# EAGLE design hyone (EAGLE 6.6.0)
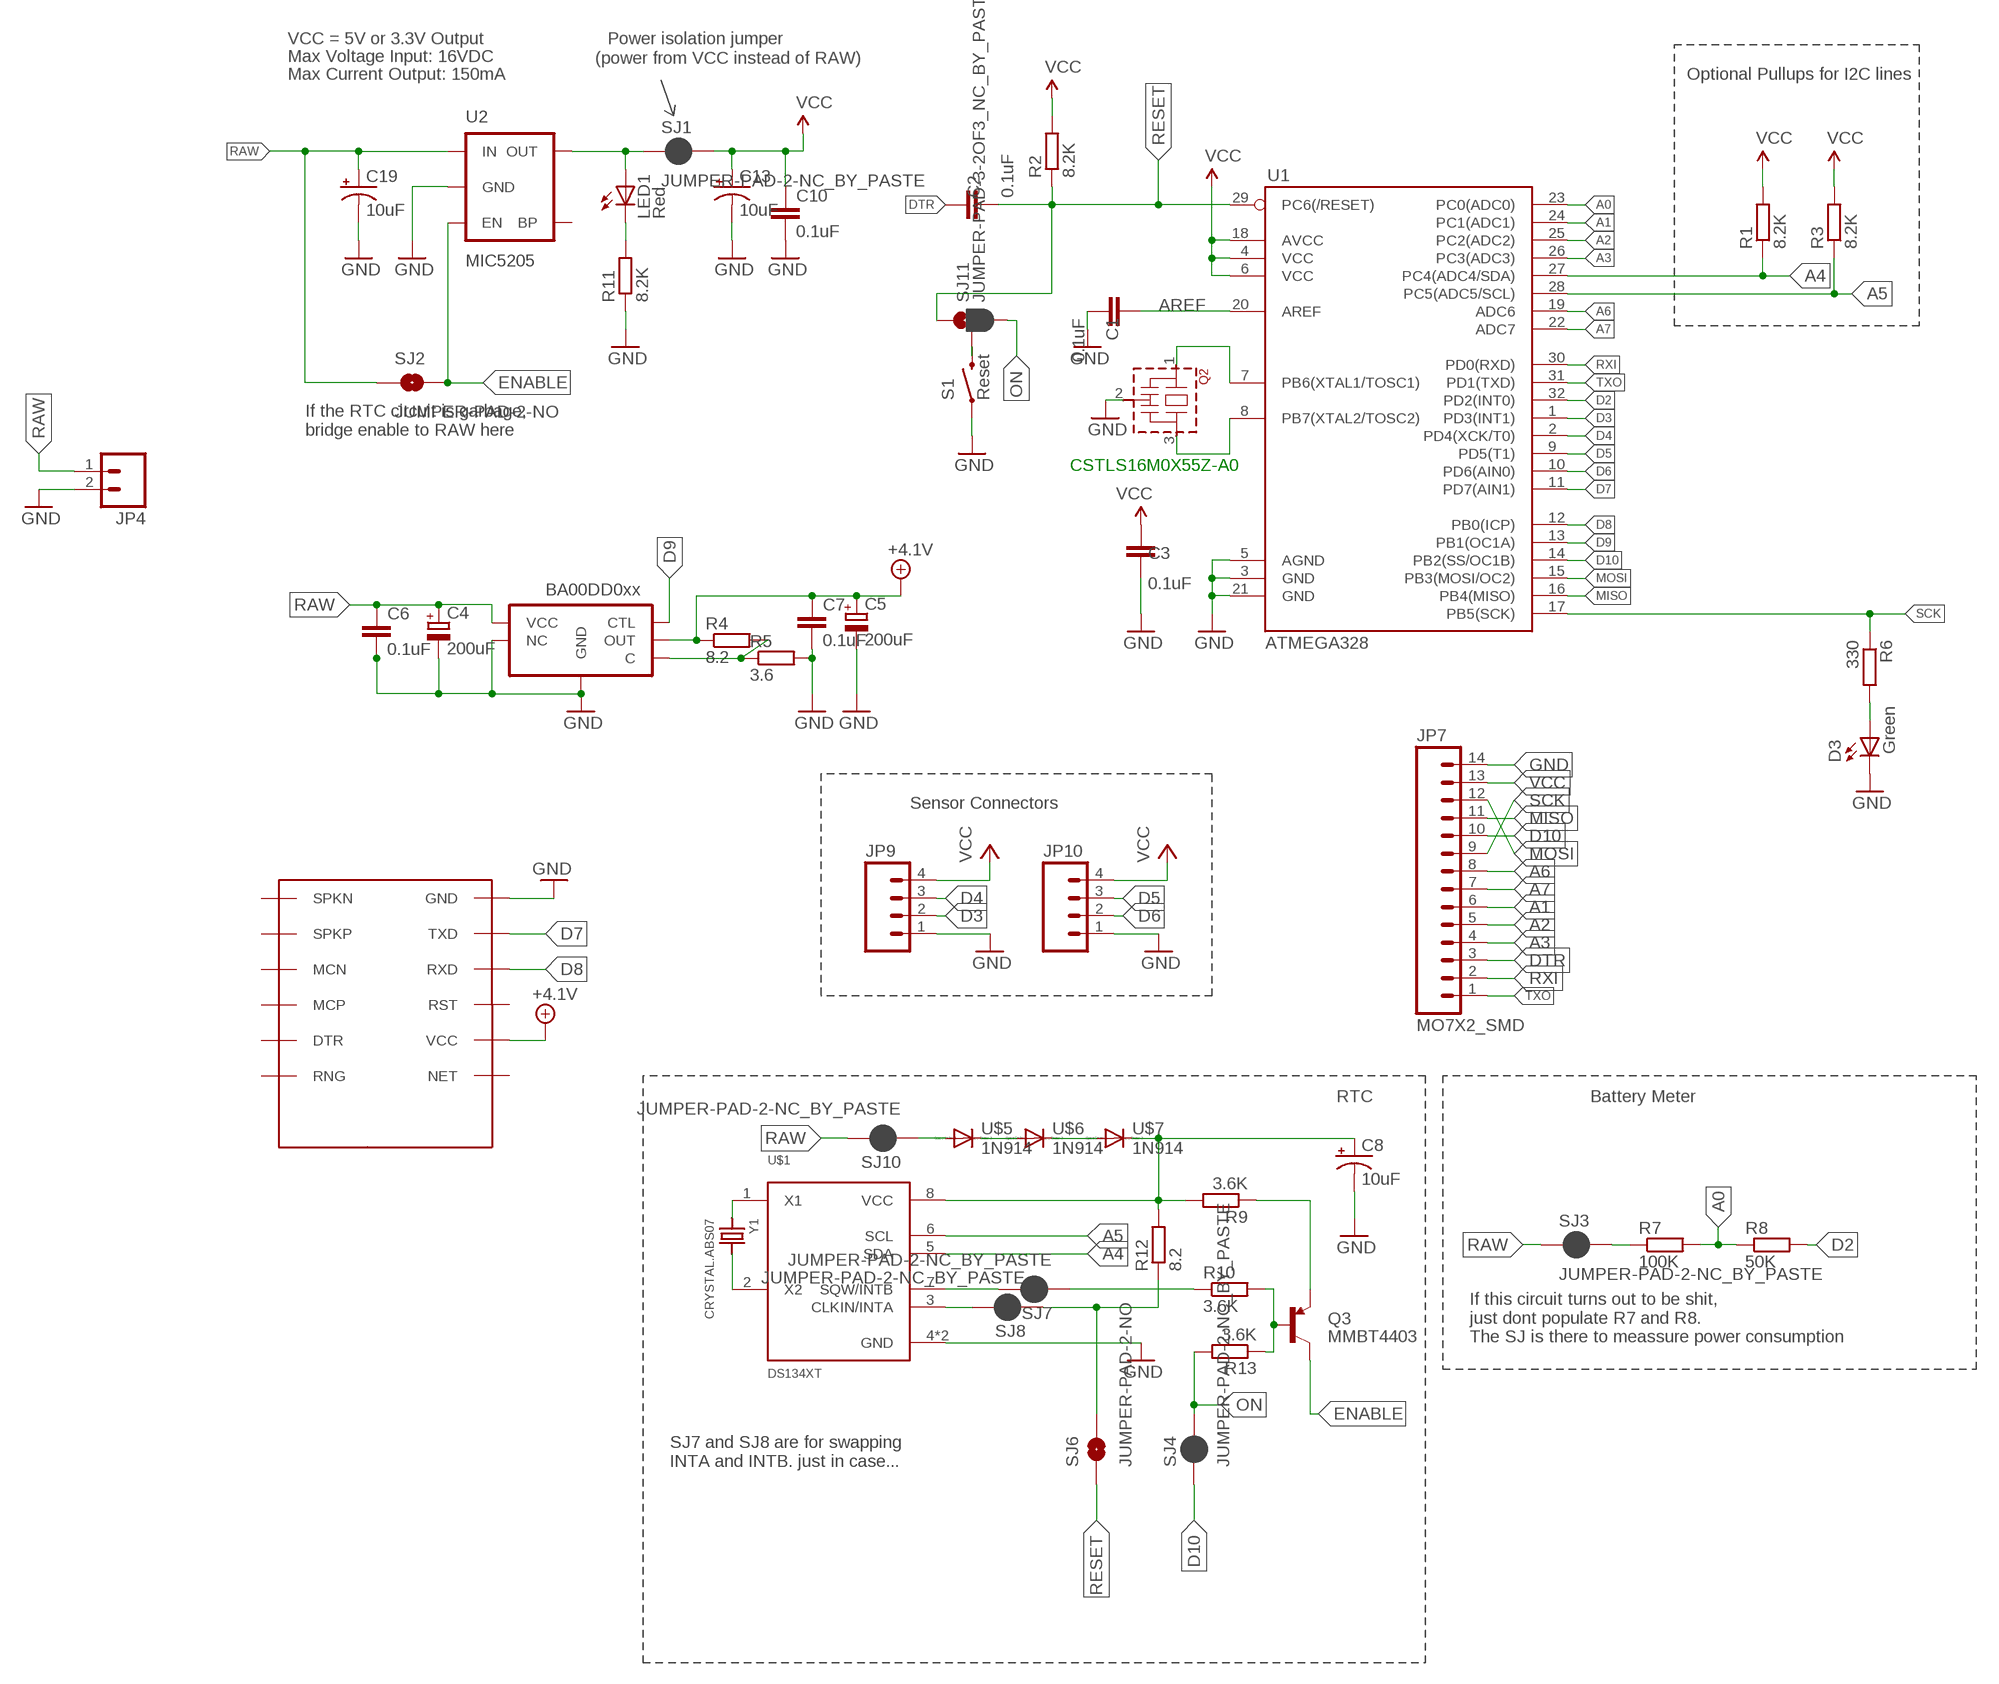
[diagram p0: schematic, sheet 1]

## Parts
C1  0.1uF  C-EUC0805  [C0805]
C2  0.1uF  C-EUC0805  [C0805]
C3  0.1uF  C-EUC0805  [C0805]
C4  200uF  CPOL-EUE5-5  [E5-5]
C5  200uF  CPOL-EUE5-5  [E5-5]
C6  0.1uF  C-EUC0805  [C0805]
C7  0.1uF  C-EUC0805  [C0805]
C8  10uF  CAP_POL1206  [EIA3216]
C10  0.1uF  C-EUC0805  [C0805]
C13  10uF  CAP_POL1206  [EIA3216]
C19  10uF  CAP_POL1206  [EIA3216]
D3  Green  LEDCHIPLED_0805  [CHIPLED_0805]
JP4  M02POLAR  [MOLEX-1X2]
JP7  MO7X2_SMD  [2X7_SMD]
JP9  M04POLAR  [MOLEX-1X4]
JP10  M04POLAR  [MOLEX-1X4]
LED1  Red  LEDCHIPLED_0805  [CHIPLED_0805]
Q2  CSTLS_X  [CSTLS_X]
Q3  MMBT4403  TRANSISTOR_PNPMMBT4403  [SOT23-3]
R1  8.2K  R-EU_R1206  [R1206]
R2  8.2K  R-EU_R1206  [R1206]
R3  8.2K  R-EU_R1206  [R1206]
R4  8.2  R-EU_R1206  [R1206]
R5  3.6  R-EU_R1206  [R1206]
R6  330  R-EU_R1206  [R1206]
R7  100K  R-EU_R1206  [R1206]
R8  50K  R-EU_R1206  [R1206]
R9  3.6K  R-EU_R1206  [R1206]
R10  3.6K  R-EU_R1206  [R1206]
R11  8.2K  R-EU_R1206  [R1206]
R12  8.2  R-EU_R1206  [R1206]
R13  3.6K  R-EU_R1206  [R1206]
S1  Reset  SWITCH-MOMENTARY-2SMD-ALT01  [TACTILE-SWITCH-SMD-ALT01]
SJ1  JUMPER-PAD-2-NC_BY_PASTE  [PAD-JUMPER-2-NC_BY_PASTE_YES_SILK]
SJ2  JUMPER-PAD-2-NO  [PAD-JUMPER-2-NO_NO_SILK]
SJ3  JUMPER-PAD-2-NC_BY_PASTE  [PAD-JUMPER-2-NC_BY_PASTE_YES_SILK]
SJ4  JUMPER-PAD-2-NC_BY_PASTE  [PAD-JUMPER-2-NC_BY_PASTE_YES_SILK]
SJ6  JUMPER-PAD-2-NO  [PAD-JUMPER-2-NO_NO_SILK]
SJ7  JUMPER-PAD-2-NC_BY_PASTE  [PAD-JUMPER-2-NC_BY_PASTE_YES_SILK]
SJ8  JUMPER-PAD-2-NC_BY_PASTE  [PAD-JUMPER-2-NC_BY_PASTE_YES_SILK]
SJ10  JUMPER-PAD-2-NC_BY_PASTE  [PAD-JUMPER-2-NC_BY_PASTE_YES_SILK]
SJ11  JUMPER-PAD-3-2OF3_NC_BY_PASTE  [PAD-JUMPER-3-2OF3_NC_BY_PASTE_YES_SILK_FULL_BOX]
U1  ATMEGA328  ATMEGA168  [TQFP32-08]
U2  MIC5205  V_REG_LDOSMD  [SOT23-5]
U$1  DS134XT  [TDFN-8]
U$2  BA00DD0XX  [HRP5]
U$4  SIM800L  [SIM-CORE]
U$5  1N914  [SOT23]
U$6  1N914  [SOT23]
U$7  1N914  [SOT23]
Y1  CRYSTAL.ABS07  [ABS07]

## Nets
123123 [vcc]: SJ10.1 U$5.1(A)
+4.1V: C5.+ C7.1 R4.1 U$2.4(OUT) U$4.VCC
A0: R7.2 R8.1 U1.23(PC0(ADC0))
A1: JP7.6 U1.24(PC1(ADC1))
A2: JP7.5 U1.25(PC2(ADC2))
A3: JP7.4 U1.26(PC3(ADC3))
A4: R1.1 U1.27(PC4(ADC4/SDA)) U$1.5(SDA)
A5: R3.1 U1.28(PC5(ADC5/SCL)) U$1.6(SCL)
A6: JP7.8 U1.19(ADC6)
A7: JP7.7 U1.22(ADC7)
AREF: C1.2 U1.20(AREF)
D2: R8.2 U1.32(PD2(INT0))
D3: JP9.2 U1.1(PD3(INT1))
D4: JP9.3 U1.2(PD4(XCK/T0))
D5: JP10.3 U1.9(PD5(T1))
D6: JP10.2 U1.10(PD6(AIN0))
D7: U1.11(PD7(AIN1)) U$4.TXD
D8: U1.12(PB0(ICP)) U$4.RXD
D9: U1.13(PB1(OC1A)) U$2.1(CTL)
D10: JP7.10 SJ4.1 U1.14(PB2(SS/OC1B))
DTR: C2.2 JP7.3
ENABLE: Q3.3(C) SJ2.2 U2.3(EN)
GND [vcc]: C1.1 C3.1 C4.- C5.- C6.2 C7.2 C8.C(-) C10.2 C13.C(-) C19.C(-) D3.C JP4.2 JP7.14 JP9.1 JP10.1 Q2.2(VSS) R5.2 R11.1 S1.1 S1.2 U1.3(GND) U1.5(AGND) U1.21(GND) U2.2(GND) U$1.4(GND) U$1.EP(GND) U$2.3(NC) U$2.6(GND) U$4.GND
MISO: JP7.11 U1.16(PB4(MISO))
MOSI: JP7.12 U1.15(PB3(MOSI/OC2))
N$1: Q2.1 U1.7(PB6(XTAL1/TOSC1))
N$2: Q2.3 U1.8(PB7(XTAL2/TOSC2))
N$3: LED1.A SJ1.1 U2.5(OUT)
N$4: LED1.C R11.2
N$5: R4.2 R5.1 U$2.5(C)
N$6: U$1.1(X1) Y1.1
N$7: D3.A R6.2
N$8: U$1.2(X2) Y1.2
N$9: Q3.2(E) R9.1
N$10: Q3.1(B) R10.2 R13.1
N$11: C8.A(+) R9.2 R12.2 U$1.8(VCC) U$7.3(C)
N$12: R10.1 SJ7.1
N$13: R7.1 SJ3.2
N$14: S1.3 S1.4 SJ11.2
N$15: R12.1 SJ6.2 SJ8.1
N$16: SJ7.2 U$1.7(SQW/INTB)
N$17: SJ8.2 U$1.3(CLKIN/INTA)
N$18: U$5.3(C) U$6.1(A)
N$19: U$6.3(C) U$7.1(A)
ON: R13.2 SJ4.2 SJ11.3
RAW [vcc]: C4.+ C6.1 C19.A(+) JP4.1 SJ2.1 SJ3.1 SJ10.2 U2.1(IN) U$2.2(VCC)
RESET: C2.1 R2.1 SJ6.1 SJ11.1 U1.29(PC6(/RESET))
RXI: JP7.2 U1.30(PD0(RXD))
SCK: JP7.9 R6.1 U1.17(PB5(SCK))
TXO: JP7.1 U1.31(PD1(TXD))
VCC: C3.2 C10.1 C13.A(+) JP7.13 JP9.4 JP10.4 R1.2 R2.2 R3.2 SJ1.2 U1.4(VCC) U1.6(VCC) U1.18(AVCC)
Unconnected: U2.4(BP) U$4.DTR U$4.MCN U$4.MCP U$4.NET U$4.RNG U$4.RST U$4.SPKN U$4.SPKP

## Notes on the sheet
- VCC = 5V or 3.3V Output | Power isolation jumper
- Max Voltage Input: 16VDC | (power from VCC instead of RAW)
- Max Current Output: 150mA | Optional Pullups for I2C lines
- If the RTC circuit is garbage, 
  bridge enable to RAW here
- CSTLS16M0X55Z-A0
- Sensor Connectors
- RTC | Battery Meter
- If this circuit turns out to be shit,
  just dont populate R7 and R8.
  The SJ is there to meassure power consumption
- SJ7 and SJ8 are for swapping 
  INTA and INTB. just in case...

## Library data of the parts
C1-C3 C6 C7 C10 = rcl:C-EU: CAPACITOR, European symbol
C4 C5 = resistor:CPOL-EU: POLARIZED CAPACITOR, European symbol
C8 C13 C19 = SparkFun:CAP_POL: Capacitor Polarized These are standard SMD and PTH capacitors. Normally 10uF, 47uF, and 100uF in electrolytic and tantalum varieties. Always verify the external diameter of the through hole cap, it varies with capacity, voltage, and manufacturer. The EIA devices should be standard.
D3 LED1 = led:LED: LED OSRAM: - CHIPLED LG R971, LG N971, LY N971, LG Q971, LY Q971, LO R971, LY R971 LH N974, LH R974 LS Q976, LO Q976, LY Q976 LO Q996 - Hyper CHIPLED LW Q18S LB Q993, LB Q99A, LB R99A - SideLED LS A670, LO A670, LY A670, LG A670, LP A670 LB A673, LV A673, LT A673, LW A673 LH A674 LY A675 LS A676, LA A676, LO A676, LY A676, LW A676 LS A679, LY A679, LG A679 - Hyper Micro SIDELED® LS Y876, LA Y876, LO Y876, LY Y876 LT Y87S - SmartLED LW L88C, LW L88S LB L89C, LB L89S, LG L890 LS L89K, LO L89K, LY L89K LS L896, LA L896, LO L896, LY L896 - TOPLED LS T670, LO T670, LY T670, LG T670, LP T670 LSG T670, LSP T670, LSY T670, LOP T670, LYG T670 LG T671, LOG T671, LSG T671 LB T673, LV T673, LT T673, LW T673 LH T674 LS T676, LA T676, LO T676, LY T676, LB T676, LH T676, LSB T676, LW T676 LB T67C, LV T67C, LT T67C, LS T67K, LO T67K, LY T67K, LW E67C LS E67B, LA E67B, LO E67B, LY E67B, LB E67C, LV E67C, LT E67C LW T67C LS T679, LY T679, LG T679 LS T770, LO T770, LY T770, LG T770, LP T770 LB T773, LV T773, LT T773, LW T773 LH T774 LS E675, LA E675, LY E675, LS T675 LS T776, LA T776, LO T776, LY T776, LB T776 LHGB T686 LT T68C, LB T68C - Hyper Mini TOPLED® LB M676 - Mini TOPLED Santana® LG M470 LS M47K, LO M47K, LY M47K Source: http://www.osram.convergy.de LUXEON: - LUMILED® LXK2-PW12-R00, LXK2-PW12-S00, LXK2-PW14-U00, LXK2-PW14-V00 LXK2-PM12-R00, LXK2-PM12-S00, LXK2-PM14-U00 LXK2-PE12-Q00, LXK2-PE12-R00, LXK2-PE12-S00, LXK2-PE14-T00, LXK2-PE14-U00 LXK2-PB12-K00, LXK2-PB12-L00, LXK2-PB12-M00, LXK2-PB14-N00, LXK2-PB14-P00, LXK2-PB14-Q00 LXK2-PR12-L00, LXK2-PR12-M00, LXK2-PR14-Q00, LXK2-PR14-R00 LXK2-PD12-Q00, LXK2-PD12-R00, LXK2-PD12-S00 LXK2-PH12-R00, LXK2-PH12-S00 LXK2-PL12-P00, LXK2-PL12-Q00, LXK2-PL12-R00 Source: www.luxeon.com KINGBRIGHT: KA-3528ASYC Source: www.kingbright.com
JP4 = SparkFun-Connectors:M02: Standard 2-pin 0.1" header. Use with - straight break away headers ( PRT-00116) - right angle break away headers (PRT-00553) - swiss pins (PRT-00743) - machine pins (PRT-00117) - female headers (PRT-00115) Molex polarized connector foot print use with: PRT-08233 with associated crimp pins and housings. 2.54_SCREWTERM for use with PRT-10571. 3.5mm Screw Terminal footprints for PRT-08084 5mm Screw Terminal footprints for use with PRT-08432
JP7 = SparkFun-Connectors:MO7X2_SMD
JP9 JP10 = SparkFun-Connectors:M04: Header 4 Standard 4-pin 0.1" header. Use with straight break away headers (SKU : PRT-00116), right angle break away headers (PRT-00553), swiss pins (PRT-00743), machine pins (PRT-00117), and female headers (PRT-00115). Molex polarized connector foot print use with SKU : PRT-08231 with associated crimp pins and housings. 1MM SMD Version SKU: PRT-10208
Q2 = murata-resonators:CSTLS_X: Ceramic resonator 16.00 to 70.00 MHz
Q3 = SparkFun-DiscreteSemi:TRANSISTOR_PNP: Generic PNP BJT Double check pinouts against datasheets- not all devices are the same! MMBT3906 - 40V 200mA SOT-23 (TRANS-08052) MMBT4403 - 40V 600mA SOT-23 (TRANS-09245); PROD_ID: TRANS-09245
R1-R3 R6 R9-R11 R13 = rcl:R-EU_: RESISTOR, European symbol
R4 R5 R7 R8 R12 = resistor:R-EU_: RESISTOR, European symbol
S1 = Testing:SWITCH-MOMENTARY-2: Various NO switches- pushbuttons, reed, etc
SJ1 SJ3 SJ4 SJ7 SJ8 SJ10 = SparkFun-Passives:JUMPER-PAD-2-NC_BY_PASTE
SJ2 SJ6 = SparkFun-Passives:JUMPER-PAD-2-NO
SJ11 = SparkFun-Passives:JUMPER-PAD-3-2OF3_NC_BY_PASTE
U1 = SparkFun:ATMEGA168
U2 = SparkFun:V_REG_LDO: Voltage Regulator LDO Standard 150mA LDO voltage regulator in SOT-23 layout. Micrel part MIC5205. BP (by-pass) pin is used to lower output noise with 470pF cap.
U$1 = borkedlabs-clock:DS134XT
U$2 = rohm-semi:BA00DD0XX
U$4 = aep:SIM800L
U$5-U$7 = diode:1N914
Y1 = abracon:CRYSTAL

## Net classes
0 default: width 0.203 mm
1 vcc: width 0.254 mm

## Board
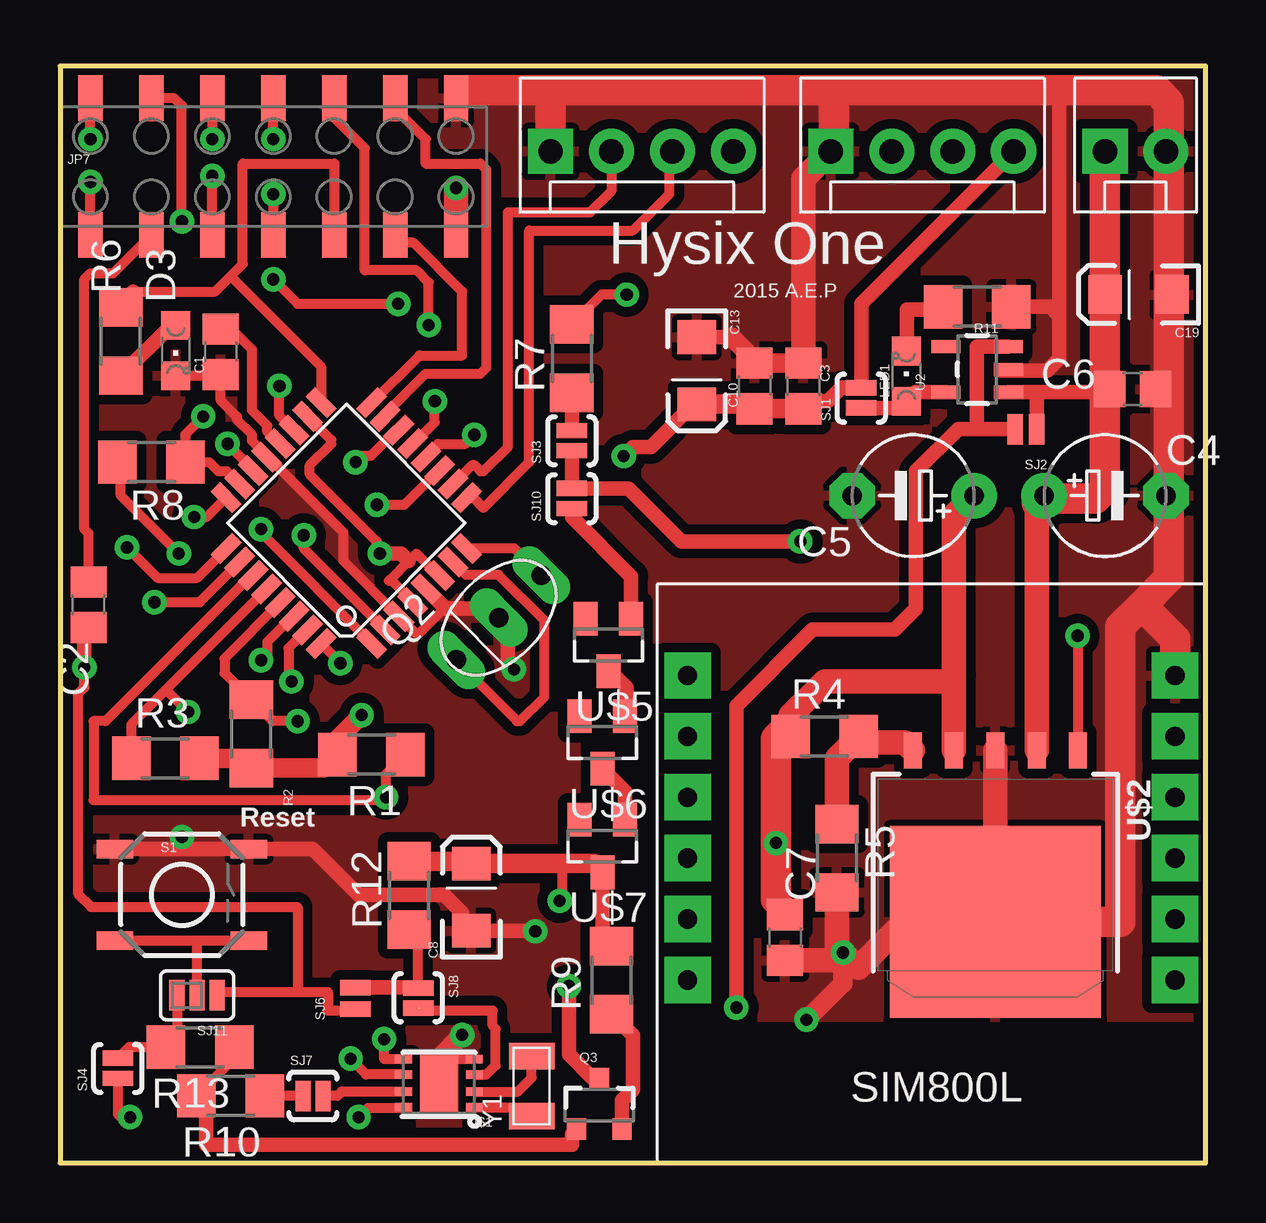
[diagram p1: board, top side]
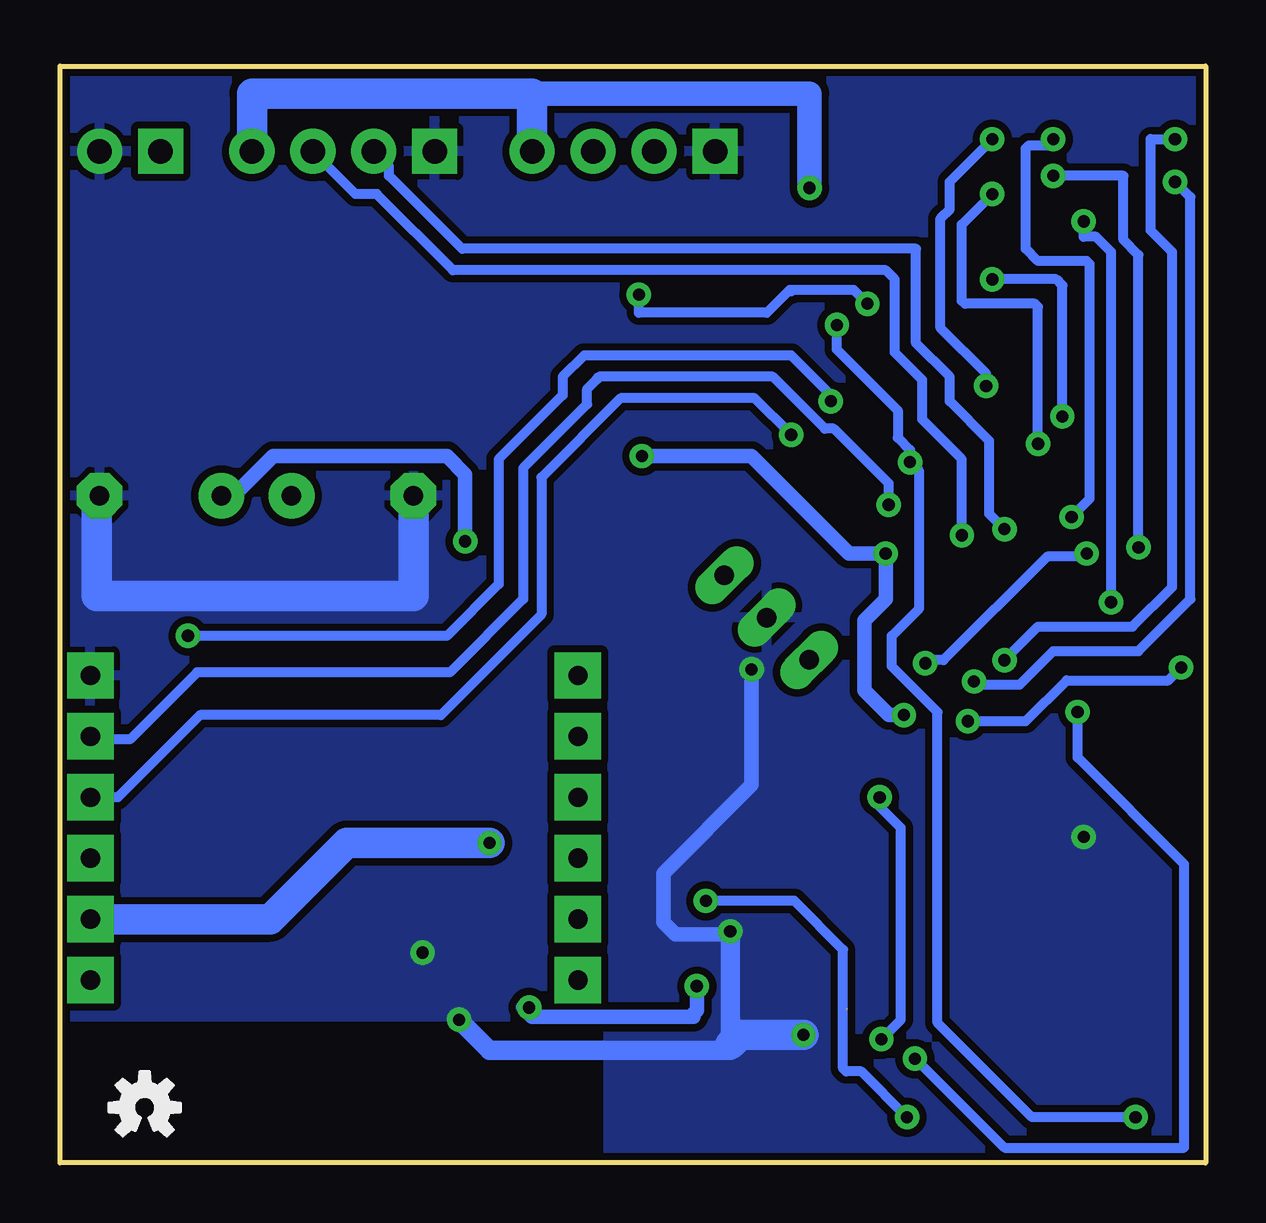
[diagram p2: board, bottom side, seen from below]

Size 47.75 x 45.72 mm. Coordinates in mm from the lower left corner, seen from the top.
Outline: 0,45.72 0,0 47.75,0 47.75,45.72 0,45.72
Copper layers (1*16): Top 0.035mm / dielectric 1.5mm / Bottom 0.035mm
Design rules "SparkFun-2-layer *": minimum track width 7mil, minimum drill 15mil, track to track 8mil, track to pad 8mil, pad to pad 8mil, via to via 8mil, smd to smd 8mil, copper to edge 8mil, drill to drill 8mil, minimum pad ring 12mil, minimum via ring 10mil, stop-mask expansion 4mil, vias tented up to drill 20mil, thermal gap 10mil

### Footprints (pad centres in the part's own frame; a part is rotated, then mirrored left to right if it is on the bottom)
C0805 = smd 1.3 x 1.5: 1 -0.95,0; 2 0.95,0
E5-5 = drill 0.813 pad 1.905: + -2.54,0 | drill 0.813 pad 1.905 octagon: - 2.54,0
EIA3216 = smd 1.4 x 1.6: A 1.4,0; C -1.4,0
CHIPLED_0805 = smd 1.2 x 1.2: A 0,-1.05; C 0,1.05
MOLEX-1X2 = drill 1.016 pad 1.88 square: 1 0,0 | drill 1.016 pad 1.88: 2 2.54,0
2X7_SMD = smd 1.02 x 1.9: 1 -7.62,-2.85; 2 -7.62,2.85; 3 -5.08,-2.85; 4 -5.08,2.85; 5 -2.54,-2.85; 6 -2.54,2.85; 7 0,-2.85; 8 0,2.85; 9 2.54,-2.85; 10 2.54,2.85; 11 5.08,-2.85; 12 5.08,2.85; 13 7.62,-2.85; 14 7.62,2.85
MOLEX-1X4 = drill 1.016 pad 1.88 square: 1 0,0 | drill 1.016 pad 1.88: 2 2.54,0; 3 5.08,0; 4 7.62,0
CSTLS_X = drill 0.813 long: 1 -2.5,0; 2 0,0; 3 2.5,0
SOT23-3 = smd 0.8 x 0.9: 1 -0.95,-1; 2 0.95,-1; 3 0,1.1
R1206 = smd 1.6 x 1.803: 1 -1.422,0; 2 1.422,0
TACTILE-SWITCH-SMD-ALT01 = smd 1.524 x 0.762: 1 -2.794,1.905; 2 2.794,1.905; 3 -2.794,-1.905; 4 2.794,-1.905
PAD-JUMPER-2-NC_BY_PASTE_YES_SILK = smd 0.635 x 1.27: 1 -0.406,0; 2 0.432,0
PAD-JUMPER-2-NO_NO_SILK = smd 0.635 x 1.27: 1 -0.45,0; 2 0.45,0
PAD-JUMPER-3-2OF3_NC_BY_PASTE_YES_SILK_FULL_BOX = smd 0.635 x 1.27: 1 -0.838,0; 2 0,0; 3 0.838,0
TQFP32-08 = smd 1.27 x 0.559: 1 -4.293,2.8; 2 -4.293,2; 3 -4.293,1.2; 4 -4.293,0.4; 5 -4.293,-0.4; 6 -4.293,-1.2; 7 -4.293,-2; 8 -4.293,-2.8; 17 4.293,-2.8; 18 4.293,-2; 19 4.293,-1.2; 20 4.293,-0.4; 21 4.293,0.4; 22 4.293,1.2; 23 4.293,2; 24 4.293,2.8 | smd 0.559 x 1.27: 9 -2.8,-4.293; 10 -2,-4.293; 11 -1.2,-4.293; 12 -0.4,-4.293; 13 0.4,-4.293; 14 1.2,-4.293; 15 2,-4.293; 16 2.8,-4.293; 25 2.8,4.293; 26 2,4.293; 27 1.2,4.293; 28 0.4,4.293; 29 -0.4,4.293; 30 -1.2,4.293; 31 -2,4.293; 32 -2.8,4.293
SOT23-5 = smd 0.55 x 1.2: 1 -0.95,-1.3; 2 0,-1.3; 3 0.95,-1.3; 4 0.95,1.3; 5 -0.95,1.3
TDFN-8 = smd 0.7 x 0.35: 1 -1.475,1; 2 -1.475,0.35; 3 -1.475,-0.35; 4 -1.475,-1; 5 1.475,-1; 6 1.475,-0.35; 7 1.475,0.35; 8 1.475,1 | smd 1.58 x 2.35: EP 0,0
HRP5 = smd 0.75 x 1.5: 1 -3.44,-1.2; 2 -1.72,-1.2; 3 0,-1.2; 4 1.72,-1.2; 5 3.44,-1.2 | smd 8.8 x 8: 6 0,5.96
SIM-CORE = drill 0.8 pad 1.93 square: DTR 21.59,13.97; GND 1.27,3.81; MCN 21.59,8.89; MCP 21.59,11.43; NET 1.27,16.51; RNG 21.59,16.51; RST 1.27,11.43; RXD 1.27,8.89; SPKN 21.59,3.81; SPKP 21.59,6.35; TXD 1.27,6.35; VCC 1.27,13.97
SOT23 = smd 1 x 1.4: 1 -0.95,-1.1; 2 0.95,-1.1; 3 0,1.1
ABS07 = smd 1.1 x 1.9: 1 -1.25,0; 2 1.25,0

### Placement (x,y rotation side)
C1  6.71,33.81 90 top
C2  1.19,23.27 90 top
C3  30.99,32.39 270 top
C4  43.56,27.81 0 top
C5  35.56,27.81 180 top
C6  44.7,32.26 0 top
C7  30.23,9.4 270 top
C8  17.14,11.07 90 top
C10  28.96,32.39 90 top
C13  26.54,33.02 270 top
C19  44.96,36.2 180 top
D3  4.83,33.86 180 top
JP4  43.56,42.16 0 top
JP7  8.89,41.53 0 top
JP9  32.13,42.16 0 top
JP10  20.45,42.16 0 top
LED1  35.28,32.79 0 top
Q2  18.29,22.73 45 top
Q3  22.48,2.41 0 top
R1  12.98,17.02 180 top
R2  7.98,17.88 270 top
R3  4.39,16.87 0 top
R4  31.88,17.78 0 top
R5  32.38,12.7 270 top
R6  2.54,34.24 270 top
R7  21.34,33.53 90 top
R8  3.81,29.21 180 top
R9  22.99,7.62 90 top
R10  7.11,2.79 180 top
R11  38.23,35.69 180 top
R12  14.55,11.15 90 top
R13  5.84,4.83 180 top
S1  5.08,11.18 0 top
SJ1  33.4,31.88 90 top
SJ2  40.26,30.58 180 top
SJ3  21.34,30.1 90 top
SJ4  2.41,3.94 90 top
SJ6  12.32,6.86 90 top
SJ7  10.54,2.79 0 top
SJ8  14.94,6.88 270 top
SJ10  21.34,27.69 90 top
SJ11  5.71,6.98 180 top
U1  11.94,26.67 135 top
U2  38.23,33.07 90 top
U$1  15.8,3.33 180 top
U$2  38.99,16 180 top
U$3  OSHW-LOGOS  [OSHW-LOGO-S]  44.22,2.31 0 bottom
U$4  47.75,24.13 180 top
U$5  22.86,21.59 180 top
U$6  22.61,17.53 180 top
U$7  22.61,13.21 180 top
Y1  19.66,3.2 90 top

### Tracks (layer width: path | path; a pad name or v marks a point on that pad's centre or on a via)
123123
  Top 0.61: SJ10.1 21.34,26.92 23.81,24.45 U$5.1
+4.1V  (via drill 0.51)
  Top 1.016: U$2.4 37.27,20.32 | 37.27,20.32 37.27,26.98 C5.+ | R4.1 30.45,18.29 30.45,18.64 31.88,20.07 37.02,20.07 37.27,20.32 | 29.84,10.98 30.23,10.6 C7.1
  Top 1.27: 30.45,18.29 29.84,17.68 v29.84,13.34 29.84,10.98
  Bottom 1.27: U$4.VCC 38.99,10.16 35.81,13.34 v29.84,13.34
A0  (via drill 0.51)
  Top 0.406: 7.4,28.29 U1.23 6.95,28.83 6.6,28.83 6.22,29.21 R8.1 5.23,30.38 v5.97,31.11 | v8.89,36.83 9.91,35.81 v14.1,35.81 | v23.62,36.2 22.58,36.2 R7.2
  Bottom 0.406: v5.97,31.11 5.97,36.58 6.22,36.83 v8.89,36.83 | 17.27,36.32 17.34,36.39 | 17.34,36.39 18.29,35.43 23.62,35.43 v23.62,36.2 | 17.34,36.39 14.67,36.39 v14.1,35.81
A1  (via drill 0.51)
  Top 0.406: v5.59,26.92 6.12,26.92 U1.24 | JP7.6 v6.35,42.67
  Bottom 0.406: v5.59,26.92 4.83,27.69 4.83,37.47 4.95,37.59 6.99,37.59 7.49,38.1 7.49,42.29 7.37,42.42 6.6,42.42 v6.35,42.67
A2  (via drill 0.51)
  Top 0.406: JP7.5 v6.35,41.15 | v2.79,25.65 4.06,24.38 5.71,24.38 6.92,25.59 U1.25
  Bottom 0.406: v2.79,25.65 2.79,37.85 3.43,38.48 3.43,41.15 v6.35,41.15
A3  (via drill 0.51)
  Top 0.406: v3.94,23.37 5.84,23.37 5.84,23.4 U1.26 | v5.08,39.24 5.08,44.07 4.77,44.38 JP7.4
  Bottom 0.406: v3.94,23.37 3.94,37.97 4.57,38.61 5.08,38.61 v5.08,39.24
A4  (via drill 0.51)
  Top 0.406: U1.27 7.97,24.48 1.91,18.41 1.4,18.41 1.4,15.11 13.46,15.11 v13.59,15.24 13.59,16.21 R1.1 | U$1.5 13.51,4.32 v13.51,5.16
  Bottom 0.406: v13.59,15.24 13.59,14.86 12.7,13.97 12.7,5.97 v13.51,5.16
A5  (via drill 0.51)
  Top 0.406: U$1.6 12.75,3.68 12.12,4.32 v12.12,4.34 | U1.28 4.35,19.65 | 4.35,19.65 2.97,18.27 R3.1 | v5.33,18.8 4.48,19.65 4.35,19.65
  Bottom 0.406: v5.33,18.8 5.33,16.89 0.89,12.45 0.89,0.64 8.38,0.64 12.09,4.34 v12.12,4.34
A6  (via drill 0.51)
  Top 0.406: U1.19 9.14,31.16 v9.14,32.39 | v8.89,42.67 JP7.8
  Bottom 0.406: v8.89,42.67 10.67,40.89 10.67,39.75 11.05,39.37 11.05,34.8 9.14,32.89 v9.14,32.39
A7  (via drill 0.51)
  Top 0.406: U1.22 8.05,28.9 v6.99,29.97 | v8.89,40.39 JP7.7
  Bottom 0.406: v6.99,29.97 6.99,35.69 7.11,35.81 10.03,35.81 10.16,35.94 10.16,39.12 v8.89,40.39
AREF
  Top 0.254: 8.76,30.35 9.13,29.99 U1.20
  Top 0.406: 8.76,30.35 8.64,30.48 8.64,30.73 8,31.37 8,33.91 7.15,34.76 C1.2
D2  (via drill 0.51)
  Top 0.406: v4.95,25.4 2.54,27.81 2.54,29.06 R8.2 | v11.68,20.83 11.68,20.85 U1.32
  Bottom 0.406: v4.95,25.4 5.08,25.27 6.6,25.27 10.92,20.95 11.56,20.95 v11.68,20.83
D3  (via drill 0.51)
  Top 0.406: U1.1 8.38,26.27 v8.38,26.42
  Bottom 0.406: v8.38,26.42 9.02,27.05 9.02,30.1 10.67,31.75 10.67,32.77 12.06,34.16 12.06,38.1 30.99,38.1 34.04,41.15 34.04,41.53 JP9.2
D4  (via drill 0.51)
  Top 0.406: U1.2 10.16,25.62 v10.16,26.16
  Bottom 0.406: v10.16,26.16 10.16,29.34 11.81,30.99 11.81,32.64 12.95,33.78 12.95,36.83 13.34,37.21 31.37,37.21 34.54,40.39 35.43,40.39 JP9.3
D5
  Top 0.406: 25.4,42.16 JP10.3 25.4,42.04 25.4,40.39 23.88,38.86 19.56,38.86 19.56,29.21 17.65,27.3 17.23,27.72 U1.9
D6
  Top 0.406: 16.39,28.33 U1.10 17.18,29.08 17.27,29.08 17.53,28.83 17.65,28.83 18.67,29.84 18.67,39.62 22.1,39.62 22.99,40.51 JP10.2
D7  (via drill 0.51)
  Top 0.254: 15.52,28.6 15.78,28.86
  Top 0.406: U1.11 15.78,28.86 | 15.52,28.6 14.35,27.43 v13.21,27.43
  Bottom 0.406: U$4.TXD 46.35,17.65 44.83,17.65 42.04,20.45 31.5,20.45 28.45,23.49 28.45,28.96 25.78,31.62 25.78,32.26 25.4,32.64 25.27,32.77 18.03,32.77 15.88,30.61 15.49,30.61 13.21,28.32 v13.21,27.43
D8  (via drill 0.51)
  Top 0.406: 15.26,29.48 U1.12 15.2,29.42 15.75,29.97 16.89,29.97 v17.27,30.35
  Bottom 0.406: v17.27,30.35 18.8,31.88 24.38,31.88 27.69,28.57 27.69,22.86 31.88,18.67 41.91,18.67 45.34,15.24 U$4.RXD
D9  (via drill 0.51)
  Top 0.406: U1.13 14.75,29.99 15.62,30.86 v15.62,31.75 | v42.42,21.97 42.42,17.21 U$2.1
  Bottom 0.406: v42.42,21.97 31.62,21.97 29.46,24.13 29.46,29.34 26.8,32 26.8,32.77 25.91,33.66 17.27,33.66 15.62,32 v15.62,31.75
D10  (via drill 0.51)
  Top 0.406: SJ4.1 2.41,2.03 2.54,1.9 v2.92,1.9 | U1.14 14.12,30.51 14,30.51 12.95,29.46 12.57,29.46 v12.32,29.21 | v15.37,34.93 15.37,36.7 14.86,37.21 12.7,37.21 12.7,42.29 11.43,43.56 JP7.10
  Bottom 0.406: v2.92,1.9 7.24,1.9 11.18,5.84 11.18,18.8 13.08,20.7 13.08,21.97 11.94,23.11 11.94,28.83 v12.32,29.21 12.32,29.72 12.83,30.23 12.83,31.37 15.37,33.91 v15.37,34.93
DTR
  Top 0.406: C2.2 1.19,26.24 1.02,26.42 1.02,36.83 1.27,37.08 2.21,37.08 JP7.3
ENABLE  (via drill 0.51)
  Top 0.61: v21.21,7.37 21.21,4.53 22.23,3.51 Q3.3 | U2.3 38.37,34.02 38.35,34.04 38.23,34.04 38.23,30.58 | SJ2.2 38.23,30.58 | 38.23,30.58 37.44,30.58 35.69,28.83 35.69,23.11 34.8,22.22 31.37,22.22 28.19,19.05 v28.19,6.48
  Bottom 0.61: v21.21,7.37 21.21,6.35 21.34,6.22 21.34,6.1 28.07,6.1 28.45,6.48 v28.19,6.48
GND  (via drill 0.51)
  Top 0.254: 39.22,33.02 39.27,33.07 U2.2 | 8.26,29.84 8.62,29.48 U1.21
  Top 0.406: U$1.4 16.01,4.33 16,4.32 16,3.53 U$1.EP | 16,23.11 14.99,22.1 14.81,22.1 U1.3 11.81,25.1 11.81,26.29 8.68,29.42 U1.21 | D3.C 6.28,32.81 | 7.22,32.86 C1.1 6.71,31.78 7.37,31.11 7.37,30.99 8,30.35 8,30.1 8.26,29.84
  Top 0.61: 41.66,35.31 41.66,44.7 | C19.C 46.23,36.07 | R11.1 41.27,35.69 41.66,35.31 | 28,34.42 C13.C | S1.1 S1.2 10.54,13.08 12.45,11.18 16,11.18 16.76,10.41 16.76,10.05 C8.C 19.79,9.67 v19.81,9.65 | v18.92,20.57 18.67,20.83 18.67,22.35 Q2.2 17.91,23.11 16,23.11 16,23.17 U1.5 | 41.66,35.31 41.66,33.53 41.15,33.02 39.22,33.02 | C6.2 46.23,32.26
  Top 0.813: U$1.EP 15.8,4.37 v16.76,5.33 | 28,34.42 28.96,33.46 C10.2 C3.1 | v31.11,5.97 32.64,7.49 v32.64,8.76 | 6.28,32.81 6.33,32.86 C1.1 | 16.84,44.7 17.02,44.7
  Top 1.016: R5.2 32.38,9.02 v32.64,8.76 | v32.64,8.76 33.27,8.13 35.19,10.04 U$2.6 38.86,10.17 38.86,13.59 38.99,13.72 U$2.3 | C7.2 32.32,8.45 v32.64,8.76 | 16.84,44.7 JP7.14 | C3.1 30.99,41.02 JP9.1
  Top 1.27: JP4.2 46.23,42.29 | 46.23,42.29 46.23,44.2 45.72,44.7 41.66,44.7 32.26,44.7 | 46.23,42.29 46.23,36.07 46.23,32.26 46.23,27.81 | 46.23,27.81 46.23,24.38 45.09,23.24 | U$2.6 44.2,10.04 44.2,22.35 45.09,23.24 | C4.- 46.23,27.81 | 32.89,27.94 C5.- | 32.26,44.7 20.45,44.7 | 20.45,44.7 17.02,44.7 | 20.45,44.7 JP10.1 | JP9.1 32.26,42.29 32.26,44.7 | U$4.GND 46.48,21.84 45.09,23.24
  Bottom 0.61: v18.92,20.57 18.92,15.75 22.61,12.07 22.61,10.03 22.1,9.53 19.94,9.53 v19.81,9.65
  Bottom 0.813: v19.81,9.65 19.81,4.95 19.81,4.7 29.84,4.7 v31.11,5.97
  Bottom 1.27: C5.- 33.02,23.62 46.23,23.62 46.23,27.69 C4.- | v16.76,5.33 19.43,5.33 19.81,4.95
  other vias: 5.08,13.59
  pour Top (isolate 0.406): 0,45.72 0,0 24.89,0 24.89,6.1 47.75,6.1 47.75,45.72
  pour Bottom (isolate 0.305): 0,45.72 0,0 24.89,0 24.89,6.1 47.75,6.1 47.75,45.72
MISO
  Top 0.406: U1.16 13.02,31.68 14.99,33.66 16.76,33.66 16.76,36.32 14.73,38.35 14.29,38.35 JP7.11 13.97,38.35
MOSI
  Top 0.406: U1.15 13.56,31.21 15.24,32.89 17.53,32.89 17.78,33.15 17.78,41.4 17.53,41.66 15.24,41.66 15.24,42.67 13.97,43.94 JP7.12
N$1
  Top 0.406: Q2.1 16.66,20.83 16.66,20.81 19.05,18.41 19.18,18.41 20.19,19.43 20.19,22.61 18.29,24.51 16.93,24.51 U1.7
N$2
  Top 0.406: Q2.3 18.94,25.61 U1.8
N$3
  Top 0.61: U2.5 35.66,32.12 LED1.A 35.01,31.47 SJ1.1
N$4
  Top 0.254: LED1.C 35.31,33.87 35.31,33.91
  Top 0.61: 35.31,33.78 35.31,33.91 35.31,35.56 36.68,35.56 R11.2
N$5
  Top 1.016: U$2.5 35.23,17.53 33.55,17.53 R4.2 32.38,16.87 R5.1
N$6
  Top 0.406: U$1.1 17.29,2.31 18.85,2.31 19.21,1.95 Y1.1
N$7
  Top 0.61: D3.A 4.63,34.91 R6.2
N$8
  Top 0.406: U$1.2 19.07,2.97 19.66,3.56 Y1.2
N$9
  Top 0.61: Q3.2 23.43,2.6 23.88,3.05 23.88,5.31 R9.1
N$10
  Top 0.254: 6.1,2.77 6.07,2.79 R10.2
  Top 0.406: 7.21,4.78 R13.1 7.26,4.37 R10.2
  Top 0.61: 6.1,2.77 6.1,0.76 21.34,0.76 21.34,1.22 Q3.1
N$11  (via drill 0.51)
  Top 0.406: U$1.8 14.28,2.29 12.83,2.29 v12.45,1.9 | v20.83,10.92 20.95,11.05 20.95,12.47
  Top 0.61: U$7.3 22.61,9.42 R9.2
  Top 0.813: R12.2 17.05,12.57 C8.A 20.95,12.47 22.24,12.47 U$7.3
  Bottom 0.406: v20.83,10.92 17.14,10.92 15.11,8.89 15.11,3.94 14.99,3.81 14.35,3.81 v12.45,1.9
N$12
  Top 0.406: SJ7.1 R10.1
N$13
  Top 0.61: SJ3.2 R7.1
N$14
  Top 0.406: S1.3 5.84,9.27 | 5.84,9.27 S1.4 | SJ11.2 5.71,9.14 5.84,9.27
N$15
  Top 0.406: SJ8.1 14.94,9.35 R12.1
  Top 0.61: SJ6.2 14.92,7.31 SJ8.1
N$16
  Top 0.406: U$1.7 11.73,2.97 11.56,2.79 SJ7.2
N$17  (1 unrouted)
  Top 0.406: U$1.3 17.65,3.68 17.78,3.68 18.16,4.06 18.16,5.59 18.03,5.71 18.03,6.35 14.99,6.35 14.99,6.42
N$18
  Top 0.61: U$5.3 22.94,20.49 23.62,19.81 23.62,18.69 U$6.1
N$19
  Top 0.61: U$7.1 23.56,15.48 U$6.3
ON
  Top 0.406: 4.01,4.41 R13.2 | R13.2 4.9,5.31 4.88,5.33 SJ11.3 | R13.2 2.87,4.83 SJ4.2
RAW  (via drill 0.51)
  Top 0.61: U2.1 40.64,32.12 | 40.64,32.12 43.44,32.12 43.44,36.08 C19.A 43.56,36.07 | SJ3.1 SJ10.2 23.7,28.12 25.91,25.91 v30.86,25.91 | C6.1 43.69,32.26 43.56,32.13 | SJ2.1 40.71,32.05 40.64,32.12
  Top 1.016: U$2.2 40.71,27.5 | C4.+ 41.02,28.07
  Top 1.27: JP4.1 43.56,36.07 43.56,32.13 43.56,28.07 43.18,27.69 41.15,27.69 C4.+ 40.71,27.5
  Bottom 0.61: v30.86,25.91 30.86,28.7 31.62,29.46 38.86,29.46 40.26,28.07 40.77,28.07 C4.+
RESET  (via drill 0.51)
  Top 0.406: U1.29 6.86,21.02 6.86,20.42 R2.1 8.86,18.41 v9.91,18.41 | 9.91,7.11 11.18,7.11 11.18,6.35 12.26,6.35 SJ6.1 | 9.91,7.11 6.66,7.11 6.55,7.01 SJ11.1 | 9.91,7.11 9.91,10.67 1.29,10.67 0.76,11.2 0.76,19.56 1.02,19.81 v1.02,20.65
  Top 0.61: v1.02,20.65 1.02,22.14 C2.1
  Bottom 0.406: v9.91,18.41 7.49,18.41 5.79,20.12 1.55,20.12 v1.02,20.65
RXI  (via drill 0.51)
  Top 0.406: v1.27,42.67 JP7.2 | 9.83,22.91 9.83,22.79 U1.30 9.71,22.79 8.64,21.72 8.64,21.21 v8.38,20.95
  Bottom 0.406: v1.27,42.67 2.29,42.67 2.29,38.86 1.4,37.97 1.4,24 3.05,22.35 6.99,22.35 v8.38,20.95
SCK
  Top 0.406: 7.11,36.96 7.62,37.47 7.62,41.66 11.43,41.66 JP7.9 | 7.11,36.96 10.88,33.19 U1.17 | 3.05,36.32 6.48,36.32 7.11,36.96
  Top 0.61: R6.1 2.54,35.81 3.05,36.32
TXO  (via drill 0.51)
  Top 0.406: JP7.1 v1.27,40.89 | U1.31 10.28,22.22 9.53,21.46 9.53,20.19 v9.65,20.07
  Bottom 0.406: v1.27,40.89 0.64,40.26 0.64,23.49 2.79,21.34 6.35,21.34 7.75,19.94 9.53,19.94 v9.65,20.07
VCC  (via drill 0.51)
  Top 0.406: 13.78,24.32 14.54,25.08 14.86,25.4 15.78,24.48 U1.6 | 13.78,24.32 13.72,24.26 | 10.41,31.12 U1.18 11.3,30.13 11.3,29.97 10.41,29.08 10.41,28.7 13.21,25.91 13.21,25.53 v13.34,25.4 | U1.4 14.69,23.41 13.78,24.32
  Top 0.61: v13.34,25.4 14.22,25.4 14.54,25.08 | C13.A 26.41,31.62 24.64,29.84 23.88,29.84 v23.5,29.46 | C3.2 31.3,31.75 32,31.75 32.56,32.31 SJ1.2 33.4,35.81 JP9.4
  Top 0.813: C3.2 C10.1 28.77,31.62 C13.A | R3.2 7.57,16.87 R2.2 11,16.46 R1.2 11.56,17.65 v12.57,18.67
  Top 1.016: JP7.13 v16.51,40.64
  Bottom 0.61: v23.5,29.46 18.92,29.46 14.86,25.4 v13.34,25.4 13.34,23.49 14.22,22.61 14.22,19.68 13.21,18.67 v12.57,18.67
  Bottom 1.016: v16.51,40.64 16.51,44.58 28.07,44.58
  Bottom 1.27: JP10.4 28.07,44.58 39.75,44.58 JP9.4

### Text on the board
tPlace: Hysix One | 2015 A.E.P | Reset